# Altium project 核心板.PrjPcb
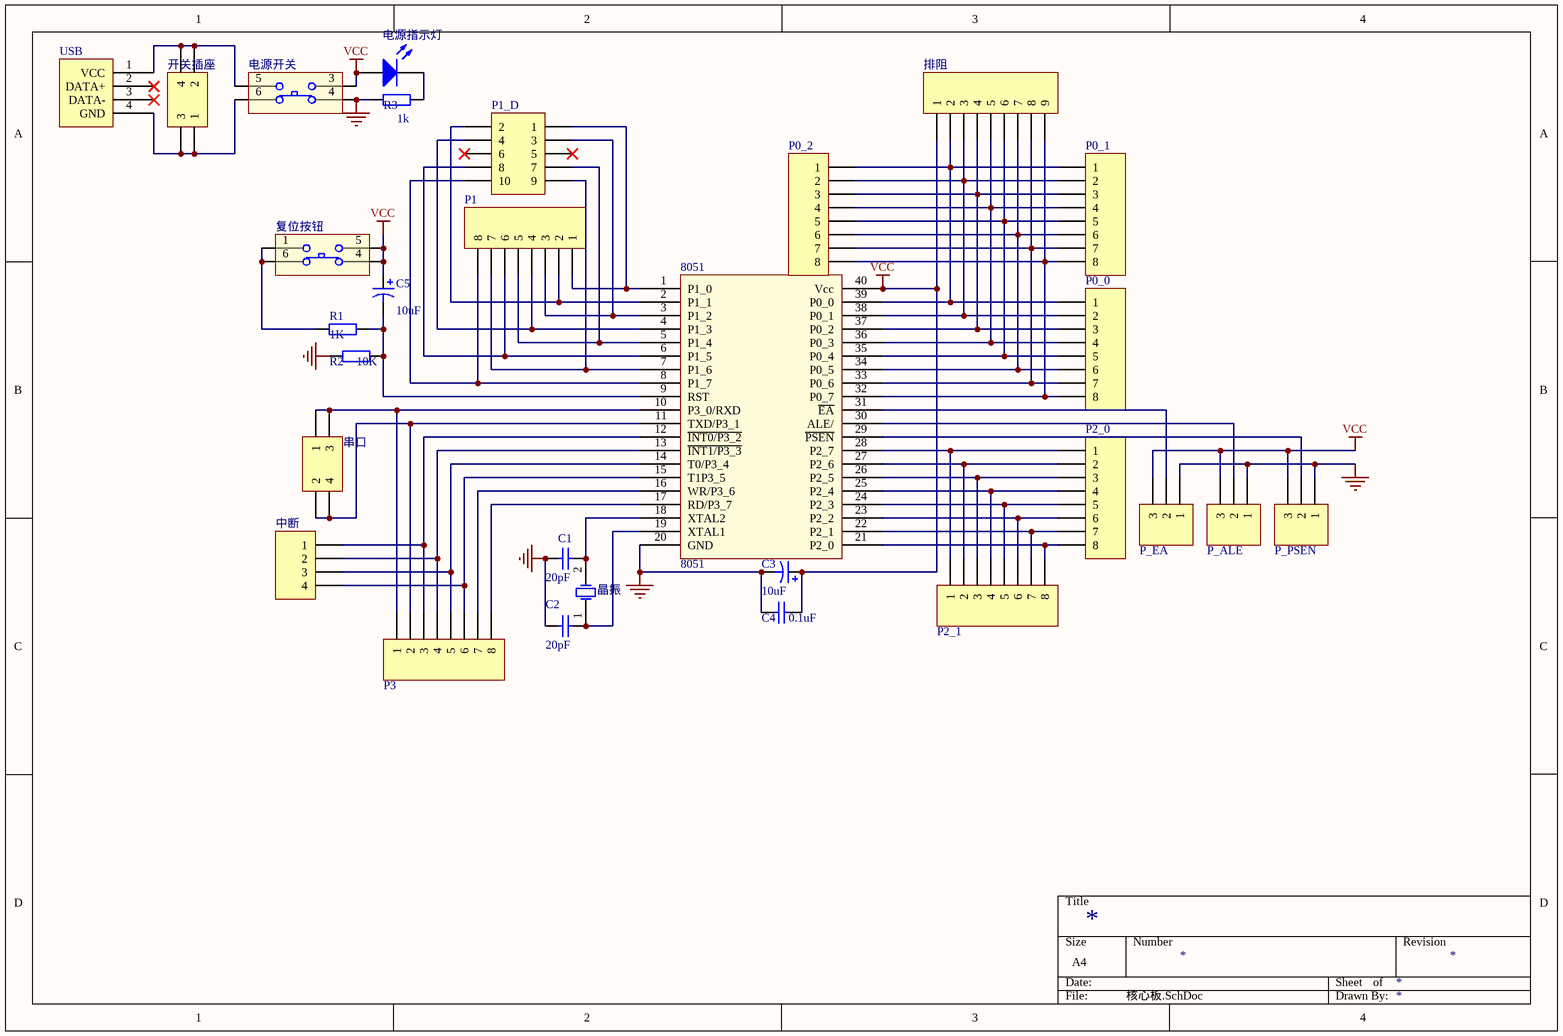
[diagram p0: 核心板.SchDoc]
1 sheet, 29 parts. Net scope: global (net labels, ports and power ports of the same name join across sheets).
Board file: 核心板.PcbDoc

## Sheet 核心板.SchDoc
size A4

### Parts
8051  8051  [DIP-40]
C1  value 20pF  [RAD-0.2]  (hidden comment: Cap)
C2  value 20pF  [rad-0.2]  (hidden comment: Cap)
C3  value 10uF  [C1206]  (hidden comment: Cap Pol1)
C4  value 0.1uF  [C0805]  (hidden comment: Cap)
C5  value 10uF  [C1206]  (hidden comment: Cap Pol1)
P0_0  Header 8  [HDR1X8]  (value not drawn)
P0_1  Header 8  [HDR1X8]  (value not drawn)
P0_2  Header 8  [HDR1X8]  (value not drawn)
P1  Header 8  [HDR1X8]  (value not drawn)
P1_D  Header 5X2  [HDR2X5]  (value not drawn)
P2_0  Header 8  [HDR1X8]  (value not drawn)
P2_1  Header 8  [HDR1X8]  (value not drawn)
P3  Header 8  [HDR1X8]  (value not drawn)
P_ALE  Header 3  [HDR1X3]  (value not drawn)
P_EA  Header 3  [HDR1X3]  (value not drawn)
P_PSEN  Header 3  [HDR1X3]  (value not drawn)
R1  value 1K  [C0805]  (hidden comment: Res2)
R2  value 10K  [C0805]  (hidden comment: Res2)
R3  value 1k  [C0805]  (hidden comment: Res2)
USB  USB  [USB-A]  (value not drawn)
中断  Header 4  [HDR1X4]  (value not drawn)
串口  Header 2X2  [HDR2X2]  (value not drawn)
复位按钮  双刀双掷按钮  [HDR2x3]  (value not drawn)
开关插座  Header 2X2  [HDR2X2]  (value not drawn)
排阻  Header 9  [HDR1X9]  (value not drawn)
晶振  XTAL  [RAD-0.2]  (value not drawn)
电源开关  双刀双掷按钮  [HDR2x3]  (value not drawn)
电源指示灯  LED0  [HDR1X2]  (value not drawn)

### Nets
GND: 8051.20(GND) C1.2 C2.2 C3.2 C4.1 P_ALE.1 P_EA.1 P_PSEN.1 R2.2 R3.1 电源开关.4
VCC: 8051.40(Vcc) C3.1 C4.2 C5.1 P_ALE.3 P_EA.3 P_PSEN.3 复位按钮.4 复位按钮.5 排阻.1 电源开关.3 电源指示灯.1(A)
Net8051_1: 8051.1(P1_0) P1.1 P1_D.1
Net8051_2: 8051.2(P1_1) P1.2 P1_D.2
Net8051_3: 8051.3(P1_2) P1.3 P1_D.3
Net8051_4: 8051.4(P1_3) P1.4 P1_D.4
Net8051_5: 8051.5(P1_4) P1.5 P1_D.7
Net8051_6: 8051.6(P1_5) P1.6 P1_D.8
Net8051_7: 8051.7(P1_6) P1.7 P1_D.9
Net8051_8: 8051.8(P1_7) P1.8 P1_D.10
Net8051_9: 8051.9(RST) C5.2 R1.1 R2.1
Net8051_10: 8051.10(P3_0/RXD) P3.1 串口.1 串口.3
Net8051_11: 8051.11(TXD/P3_1) P3.2 串口.2 串口.4
Net8051_12: 8051.12(~{INT0/P3_2}) P3.3 中断.1
Net8051_13: 8051.13(~{INT1/P3_3}) P3.4 中断.2
Net8051_14: 8051.14(T0/P3_4) P3.5 中断.3
Net8051_15: 8051.15(T1P3_5) P3.6 中断.4
Net8051_16: 8051.16(WR/P3_6) P3.7
Net8051_17: 8051.17(RD/P3_7) P3.8
Net8051_18: 8051.18(XTAL2) C1.1 晶振.2(OSC2)
Net8051_19: 8051.19(XTAL1) C2.1 晶振.1(OSC1)
Net8051_21: 8051.21(P2_0) P2_0.8 P2_1.8
Net8051_22: 8051.22(P2_1) P2_0.7 P2_1.7
Net8051_23: 8051.23(P2_2) P2_0.6 P2_1.6
Net8051_24: 8051.24(P2_3) P2_0.5 P2_1.5
Net8051_25: 8051.25(P2_4) P2_0.4 P2_1.4
Net8051_26: 8051.26(P2_5) P2_0.3 P2_1.3
Net8051_27: 8051.27(P2_6) P2_0.2 P2_1.2
Net8051_28: 8051.28(P2_7) P2_0.1 P2_1.1
Net8051_29: 8051.29(~{PSEN}) P_PSEN.2
Net8051_30: 8051.30(ALE/) P_ALE.2
Net8051_31: 8051.31(~{EA}) P_EA.2
Net8051_32: 8051.32(P0_7) P0_0.8 P0_1.8 P0_2.8 排阻.9
Net8051_33: 8051.33(P0_6) P0_0.7 P0_1.7 P0_2.7 排阻.8
Net8051_34: 8051.34(P0_5) P0_0.6 P0_1.6 P0_2.6 排阻.7
Net8051_35: 8051.35(P0_4) P0_0.5 P0_1.5 P0_2.5 排阻.6
Net8051_36: 8051.36(P0_3) P0_0.4 P0_1.4 P0_2.4 排阻.5
Net8051_37: 8051.37(P0_2) P0_0.3 P0_1.3 P0_2.3 排阻.4
Net8051_38: 8051.38(P0_1) P0_0.2 P0_1.2 P0_2.2 排阻.3
Net8051_39: 8051.39(P0_0) P0_0.1 P0_1.1 P0_2.1 排阻.2
NetR1_2: R1.2 复位按钮.1 复位按钮.6
NetR3_2: R3.2 电源指示灯.2(K)
NetUSB_1: USB.1(VCC) 开关插座.2 开关插座.4 电源开关.5
NetUSB_4: USB.4(GND) 开关插座.1 开关插座.3 电源开关.6

Not connected (* = marked no-connect by the designer): P1_D 5* 6*; USB 2(DATA+)* 3(DATA-)* 5(NC) 6(NC); 复位按钮 2; 电源开关 2

### Library data of the parts
C1 C2 C4 = Cap: Capacitor; Published: 8-Jun-2000; LatestRevisionDate: 17-Jul-2002; LatestRevisionNote: Re-released for DXP Platform.; PackageReference: RAD-0.3; Publisher: Altium Limited
C3 C5 = Cap Pol1: Polarized Capacitor (Radial); Published: 8-Jun-2000; LatestRevisionDate: 17-Jul-2002; LatestRevisionNote: Re-released for DXP Platform.; PackageReference: RB7.6-15; Publisher: Altium Limited
P0_0-P0_2 P1 P2_0 P2_1 P3 = Header 8: Header, 8-Pin; LatestRevisionDate: 17-Jul-2002; LatestRevisionNote: Re-released for DXP Platform.; Publisher: Altium Limited
P1_D = Header 5x2: Header, 5-Pin, Dual row; LatestRevisionDate: 17-Jul-2002; LatestRevisionNote: Re-released for DXP Platform.; Publisher: Altium Limited
P_ALE P_EA P_PSEN = Header 3: Header, 3-Pin; LatestRevisionDate: 17-Jul-2002; LatestRevisionNote: Re-released for DXP Platform.; Publisher: Altium Limited
R1-R3 = Res2: Resistor; Published: 8-Jun-2000; LatestRevisionDate: 17-Jul-2002; LatestRevisionNote: Re-released for DXP Platform.; PackageReference: AXIAL-0.4; Publisher: Altium Limited
中断 = Header 4: Header, 4-Pin; LatestRevisionDate: 17-Jul-2002; LatestRevisionNote: Re-released for DXP Platform.; Publisher: Altium Limited
串口 开关插座 = Header 2x2: Header, 2-Pin, Dual row; LatestRevisionDate: 17-Jul-2002; LatestRevisionNote: Re-released for DXP Platform.; Publisher: Altium Limited
排阻 = Header 9: Header, 9-Pin; LatestRevisionDate: 17-Jul-2002; LatestRevisionNote: Re-released for DXP Platform.; Publisher: Altium Limited
晶振 = XTAL: Crystal Oscillator; Published: 8-Jun-2000; LatestRevisionDate: 17-Jul-2002; LatestRevisionNote: Re-released for DXP Platform.; PackageReference: R38; Publisher: Altium Limited
电源指示灯 = LED0: Typical INFRARED GaAs LED; Published: 8-Jun-2000; LatestRevisionDate: 08-Jul-2005; LatestRevisionNote: Mech Layer 1 removed.; PackageReference: LED-0; Publisher: Altium Limited